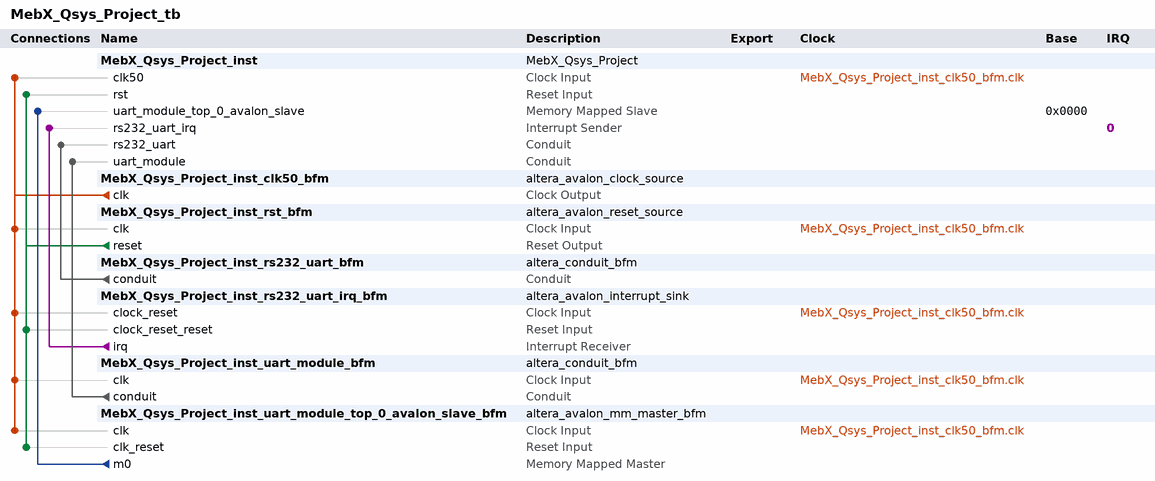
[diagram p0: system contents]
# Platform Designer (Qsys) system MebX_Qsys_Project_tb, Stratix IV EP4SGX530KH40C2
# Parameters at their usual value, and those the tool derives, are not listed.
package require -exact qsys 18.1
create_system MebX_Qsys_Project_tb
set_project_property DEVICE_FAMILY {Stratix IV}
set_project_property DEVICE EP4SGX530KH40C2

add_instance MebX_Qsys_Project_inst MebX_Qsys_Project 1.0

add_instance MebX_Qsys_Project_inst_clk50_bfm altera_avalon_clock_source 18.1

add_instance MebX_Qsys_Project_inst_rst_bfm altera_avalon_reset_source 18.1
set_instance_parameter_value MebX_Qsys_Project_inst_rst_bfm ASSERT_HIGH_RESET 0
set_instance_parameter_value MebX_Qsys_Project_inst_rst_bfm INITIAL_RESET_CYCLES 50

add_instance MebX_Qsys_Project_inst_rs232_uart_bfm altera_conduit_bfm 18.1
set_instance_parameter_value MebX_Qsys_Project_inst_rs232_uart_bfm CLOCKED_SIGNAL false
set_instance_parameter_value MebX_Qsys_Project_inst_rs232_uart_bfm ENABLE_RESET false
set_instance_parameter_value MebX_Qsys_Project_inst_rs232_uart_bfm SIGNAL_DIRECTIONS output,input,output,input
set_instance_parameter_value MebX_Qsys_Project_inst_rs232_uart_bfm SIGNAL_ROLES cts_n,rts_n,rxd,txd
set_instance_parameter_value MebX_Qsys_Project_inst_rs232_uart_bfm SIGNAL_WIDTHS 1,1,1,1

add_instance MebX_Qsys_Project_inst_rs232_uart_irq_bfm altera_avalon_interrupt_sink 18.1
set_instance_parameter_value MebX_Qsys_Project_inst_rs232_uart_irq_bfm ASSERT_HIGH_IRQ 1
set_instance_parameter_value MebX_Qsys_Project_inst_rs232_uart_irq_bfm ASYNCHRONOUS_INTERRUPT 0
set_instance_parameter_value MebX_Qsys_Project_inst_rs232_uart_irq_bfm AV_IRQ_W 1
set_instance_parameter_value MebX_Qsys_Project_inst_rs232_uart_irq_bfm VHDL_ID 0

add_instance MebX_Qsys_Project_inst_uart_module_bfm altera_conduit_bfm 18.1
set_instance_parameter_value MebX_Qsys_Project_inst_uart_module_bfm CLOCKED_SIGNAL true
set_instance_parameter_value MebX_Qsys_Project_inst_uart_module_bfm ENABLE_RESET false
set_instance_parameter_value MebX_Qsys_Project_inst_uart_module_bfm SIGNAL_DIRECTIONS input,output,output,input
set_instance_parameter_value MebX_Qsys_Project_inst_uart_module_bfm SIGNAL_ROLES uart_cts_signal,uart_rts_signal,uart_rxd_signal,uart_txd_signal
set_instance_parameter_value MebX_Qsys_Project_inst_uart_module_bfm SIGNAL_WIDTHS 1,1,1,1

add_instance MebX_Qsys_Project_inst_uart_module_top_0_avalon_slave_bfm altera_avalon_mm_master_bfm 18.1
set_instance_parameter_value MebX_Qsys_Project_inst_uart_module_top_0_avalon_slave_bfm ADDRESS_UNITS WORDS
set_instance_parameter_value MebX_Qsys_Project_inst_uart_module_top_0_avalon_slave_bfm AV_ADDRESS_W 8
set_instance_parameter_value MebX_Qsys_Project_inst_uart_module_top_0_avalon_slave_bfm AV_ALWAYS_BURST_MAX_BURST 0
set_instance_parameter_value MebX_Qsys_Project_inst_uart_module_top_0_avalon_slave_bfm AV_BURSTCOUNT_W 1
set_instance_parameter_value MebX_Qsys_Project_inst_uart_module_top_0_avalon_slave_bfm AV_BURST_BNDR_ONLY 0
set_instance_parameter_value MebX_Qsys_Project_inst_uart_module_top_0_avalon_slave_bfm AV_BURST_LINEWRAP 0
set_instance_parameter_value MebX_Qsys_Project_inst_uart_module_top_0_avalon_slave_bfm AV_CONSTANT_BURST_BEHAVIOR 1
set_instance_parameter_value MebX_Qsys_Project_inst_uart_module_top_0_avalon_slave_bfm AV_FIX_READ_LATENCY 0
set_instance_parameter_value MebX_Qsys_Project_inst_uart_module_top_0_avalon_slave_bfm AV_MAX_PENDING_WRITES 0
set_instance_parameter_value MebX_Qsys_Project_inst_uart_module_top_0_avalon_slave_bfm AV_NUMSYMBOLS 4
set_instance_parameter_value MebX_Qsys_Project_inst_uart_module_top_0_avalon_slave_bfm AV_READRESPONSE_W 1
set_instance_parameter_value MebX_Qsys_Project_inst_uart_module_top_0_avalon_slave_bfm AV_READ_WAIT_TIME 1
set_instance_parameter_value MebX_Qsys_Project_inst_uart_module_top_0_avalon_slave_bfm AV_WRITERESPONSE_W 1
set_instance_parameter_value MebX_Qsys_Project_inst_uart_module_top_0_avalon_slave_bfm USE_BURSTCOUNT 0
set_instance_parameter_value MebX_Qsys_Project_inst_uart_module_top_0_avalon_slave_bfm USE_BYTE_ENABLE 0
set_instance_parameter_value MebX_Qsys_Project_inst_uart_module_top_0_avalon_slave_bfm USE_READ 1
set_instance_parameter_value MebX_Qsys_Project_inst_uart_module_top_0_avalon_slave_bfm USE_READ_DATA 1
set_instance_parameter_value MebX_Qsys_Project_inst_uart_module_top_0_avalon_slave_bfm USE_READ_DATA_VALID 0
set_instance_parameter_value MebX_Qsys_Project_inst_uart_module_top_0_avalon_slave_bfm USE_WAIT_REQUEST 1
set_instance_parameter_value MebX_Qsys_Project_inst_uart_module_top_0_avalon_slave_bfm VHDL_ID 0

# connections
add_connection MebX_Qsys_Project_inst_clk50_bfm.clk MebX_Qsys_Project_inst.clk50 clock
add_connection MebX_Qsys_Project_inst_clk50_bfm.clk MebX_Qsys_Project_inst_rs232_uart_irq_bfm.clock_reset clock
add_connection MebX_Qsys_Project_inst_clk50_bfm.clk MebX_Qsys_Project_inst_rst_bfm.clk clock
add_connection MebX_Qsys_Project_inst_clk50_bfm.clk MebX_Qsys_Project_inst_uart_module_bfm.clk clock
add_connection MebX_Qsys_Project_inst_clk50_bfm.clk MebX_Qsys_Project_inst_uart_module_top_0_avalon_slave_bfm.clk clock
add_connection MebX_Qsys_Project_inst_rst_bfm.reset MebX_Qsys_Project_inst.rst reset
add_connection MebX_Qsys_Project_inst_rst_bfm.reset MebX_Qsys_Project_inst_rs232_uart_irq_bfm.clock_reset_reset reset
add_connection MebX_Qsys_Project_inst_rst_bfm.reset MebX_Qsys_Project_inst_uart_module_top_0_avalon_slave_bfm.clk_reset reset
add_connection MebX_Qsys_Project_inst_uart_module_top_0_avalon_slave_bfm.m0 MebX_Qsys_Project_inst.uart_module_top_0_avalon_slave avalon
set_connection_parameter_value MebX_Qsys_Project_inst_uart_module_top_0_avalon_slave_bfm.m0/MebX_Qsys_Project_inst.uart_module_top_0_avalon_slave baseAddress 0x0000
add_connection MebX_Qsys_Project_inst_rs232_uart_bfm.conduit MebX_Qsys_Project_inst.rs232_uart conduit
add_connection MebX_Qsys_Project_inst_uart_module_bfm.conduit MebX_Qsys_Project_inst.uart_module conduit
add_connection MebX_Qsys_Project_inst_rs232_uart_irq_bfm.irq MebX_Qsys_Project_inst.rs232_uart_irq interrupt
set_connection_parameter_value MebX_Qsys_Project_inst_rs232_uart_irq_bfm.irq/MebX_Qsys_Project_inst.rs232_uart_irq irqNumber 0

set_interconnect_requirement {$system} qsys_mm.clockCrossingAdapter HANDSHAKE
set_interconnect_requirement {$system} qsys_mm.enableEccProtection FALSE
set_interconnect_requirement {$system} qsys_mm.insertDefaultSlave FALSE
set_interconnect_requirement {$system} qsys_mm.maxAdditionalLatency 1

save_system MebX_Qsys_Project_tb.qsys
